# Altium schematic sheet PCA_0006_Mini_CB_Power_REV_B.SchDoc
size A4; DrawnBy: Philip Rowse
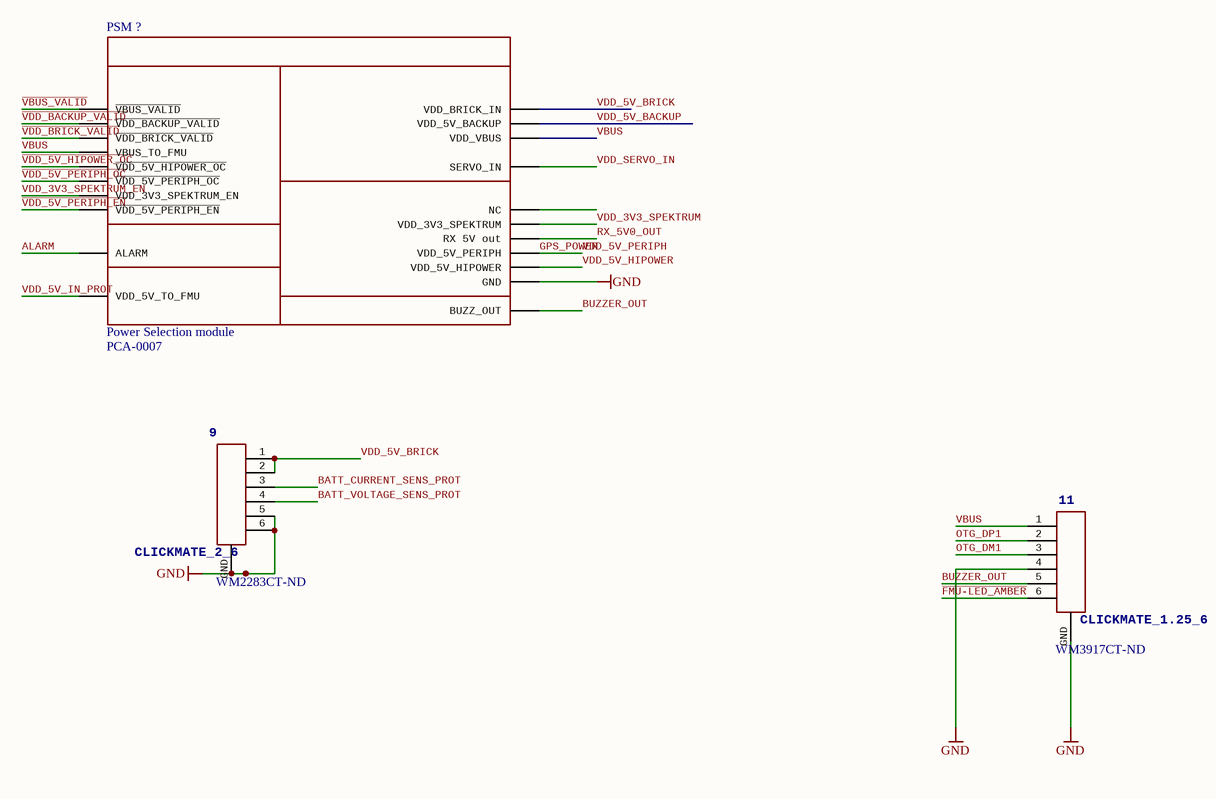
[diagram p0: PCA_0006_Mini_CB_Power_REV_B.SchDoc]

## Parts
9  CLICKMATE_2_6  Supplier Part Number 1: WM2283CT-ND  [CLICKMATE_H6_2MM]
11  CLICKMATE_1.25_6  Supplier Part Number 1: WM3917CT-ND  [CLICKMATE_H6]
PSM_?  Power Selection module  Supplier Part Number 1: PCA-0007  [PSM]

## Nets
GND: 9.5 9.6 9.GND 11.4 11.GND PSM_?.GND
ALARM: PSM_?.ALARM
BATT_CURRENT_SENS_PROT: 9.3
BATT_VOLTAGE_SENS_PROT: 9.4
BUZZER_OUT: 11.5 PSM_?.BUZZER_OUT(BUZZ_OUT)
~{FMU-LED_AMBER}: 11.6
GPS_POWER: PSM_?.5V_PERIPH(VDD_5V_PERIPH)  [also labelled VDD_5V_PERIPH]
OTG_DM1: 11.3
OTG_DP1: 11.2
RX_5V0_OUT: PSM_?.RX(RX_5V_out)
~{VBUS_VALID}: PSM_?.!VBUS_VALID(~{VBUS_VALID})
~{VDD_5V_HIPOWER_OC}: PSM_?.!VDD_5V_HIPOWER_OC(~{VDD_5V_HIPOWER_OC})
~{VDD_5V_PERIPH_EN}: PSM_?.!VDD_5V_PERIPH_EN(~{VDD_5V_PERIPH_EN})
~{VDD_5V_PERIPH_OC}: PSM_?.!VDD_5V_PERIPH_OC(~{VDD_5V_PERIPH_OC})
~{VDD_BACKUP_VALID}: PSM_?.!VDD_BACKUP_VALID(~{VDD_BACKUP_VALID})
~{VDD_BRICK_VALID}: PSM_?.!VDD_BRICK_VALID(~{VDD_BRICK_VALID})
VBUS: 11.1 PSM_?.VBUS(VBUS_TO_FMU) PSM_?.VDD_VBUS
VDD_3V3_SPEKTRUM: PSM_?.SPEK(VDD_3V3_SPEKTRUM)
VDD_3V3_SPEKTRUM_EN: PSM_?.VDD_3V3_SPEKTRUM_EN
VDD_5V_BACKUP: PSM_?.VDD_5V_BACKUP
VDD_5V_BRICK: 9.1 9.2 PSM_?.VDD_BRICK_IN
VDD_5V_HIPOWER: PSM_?.5V_HIPOWER(VDD_5V_HIPOWER)
VDD_5V_IN_PROT: PSM_?.VDD_5V_IN_PROT(VDD_5V_TO_FMU)
VDD_SERVO_IN: PSM_?.SERVO_IN

Not connected (* = marked no-connect by the designer): PSM_? NC

## Notes on the sheet
- This licence Applies to this doccument ONLY, other components that make up the full system come with their own licences, please check with the Author for further information
- To the extent possible under law, Philip Rowse and 3DRobotics has waived all copyright and related or neighboring
- rights to Carrier board for APM 3.0 series. This work is published from: United States, and Australia
- Title:
- Date:
- Time:
- For information on this Licence: http://creativecommons.org/publicdomain/zero/1.0/
- Sheet:
- Approved:
- of:
- Drawn By:
- Checked By:
- 3DRobotics

## Library data of the parts
9 = CLICKMATE_2_6: Connector, Receptacle, 6Pos, 2.00MM, R/A, PCB, Tin; 3DR_PARTNO: ECM0534; Supplier 1: Digi-Key
11 = CLICKMATE_1.25_6: 1.25 W/B SGL R/A REC ASSY 6CKT; 3DR_PARTNO: ECM0532; Supplier 1: Digi-Key
PSM_? = PSMPSM: PCA, PSM, PX4, Assembly; Manufacturer 1: 3DR; Mfg Part Num (Alternate): DO NOT SWAP; 3DR_PARTNO: PCA0007; Manufacturer Part Number 1: PCA-0007; Supplier 1: 3DR; Supplier Unit Price 1: 17; Supplier Currency 1: USD; Supplier Order Qty 1: 100